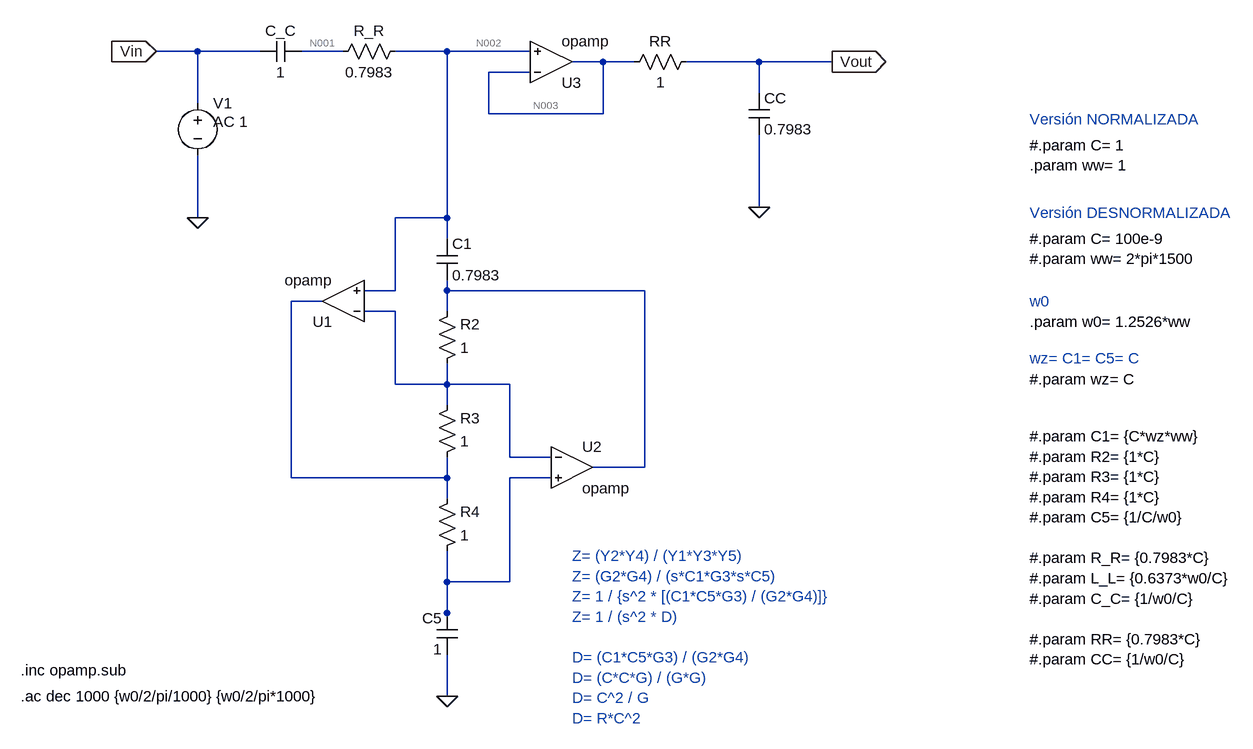
[diagram p0: schematic TS3_LTSpice_FDNR_v2.asc]
TS3_LTSpice_FDNR_v2.asc, the LTspice schematic file:
Version 4
SHEET 1 2464 1004
WIRE -32 -416 -96 -416
WIRE 64 -416 -32 -416
WIRE 192 -416 128 -416
WIRE 352 -416 272 -416
WIRE 480 -416 352 -416
WIRE 592 -400 544 -400
WIRE 640 -400 592 -400
WIRE 832 -400 720 -400
WIRE 944 -400 832 -400
WIRE 480 -384 416 -384
WIRE 832 -352 832 -400
WIRE -32 -336 -32 -416
WIRE 416 -320 416 -384
WIRE 592 -320 592 -400
WIRE 592 -320 416 -320
WIRE 832 -176 832 -288
WIRE -32 -160 -32 -256
WIRE 352 -160 352 -416
WIRE 352 -160 272 -160
WIRE 352 -128 352 -160
WIRE 272 -48 272 -160
WIRE 272 -48 224 -48
WIRE 352 -48 352 -64
WIRE 656 -48 352 -48
WIRE 160 -32 112 -32
WIRE 272 -16 224 -16
WIRE 352 -16 352 -48
WIRE 272 96 272 -16
WIRE 352 96 352 64
WIRE 352 96 272 96
WIRE 448 96 352 96
WIRE 352 128 352 96
WIRE 448 208 448 96
WIRE 512 208 448 208
WIRE 656 224 656 -48
WIRE 656 224 576 224
WIRE 112 240 112 -32
WIRE 352 240 352 208
WIRE 352 240 112 240
WIRE 512 240 448 240
WIRE 352 272 352 240
WIRE 352 400 352 352
WIRE 448 400 448 240
WIRE 448 400 352 400
WIRE 352 448 352 400
WIRE 352 464 352 448
WIRE 352 576 352 512
FLAG -96 -416 Vin
IOPIN -96 -416 In
FLAG 944 -400 Vout
IOPIN 944 -400 Out
FLAG 832 -176 0
FLAG -32 -160 0
FLAG 352 576 0
SYMBOL Opamps\\opamp 192 32 R180
SYMATTR InstName U1
SYMBOL Opamps\\opamp 544 160 R0
SYMATTR InstName U2
SYMBOL cap 336 -64 M180
WINDOW 0 24 56 Left 2
WINDOW 3 24 8 Left 2
SYMATTR InstName C1
SYMATTR Value 0.7983
SYMBOL cap 368 448 M0
SYMATTR InstName C5
SYMATTR Value 1
SYMBOL res 336 80 M180
WINDOW 0 36 76 Left 2
WINDOW 3 36 40 Left 2
SYMATTR InstName R2
SYMATTR Value 1
SYMBOL res 336 224 M180
WINDOW 0 36 76 Left 2
WINDOW 3 36 40 Left 2
SYMATTR InstName R3
SYMATTR Value 1
SYMBOL res 336 368 M180
WINDOW 0 36 76 Left 2
WINDOW 3 36 40 Left 2
SYMATTR InstName R4
SYMATTR Value 1
SYMBOL cap 128 -432 R90
WINDOW 0 0 32 VBottom 2
WINDOW 3 32 32 VTop 2
SYMATTR InstName C_C
SYMATTR Value 1
SYMBOL res 288 -432 R90
WINDOW 0 0 56 VBottom 2
WINDOW 3 32 56 VTop 2
SYMATTR InstName R_R
SYMATTR Value 0.7983
SYMBOL Opamps\\opamp 512 -336 M180
SYMATTR InstName U3
SYMBOL res 736 -416 R90
WINDOW 0 0 56 VBottom 2
WINDOW 3 32 56 VTop 2
SYMATTR InstName RR
SYMATTR Value 1
SYMBOL cap 816 -352 R0
SYMATTR InstName CC
SYMATTR Value 0.7983
SYMBOL voltage -32 -352 R0
WINDOW 123 24 44 Left 2
WINDOW 39 0 0 Left 0
SYMATTR Value2 AC 1
SYMATTR InstName V1
SYMATTR Value ""
TEXT -304 536 Left 2 !.inc opamp.sub
TEXT 544 360 Left 2 ;Z= (Y2*Y4) / (Y1*Y3*Y5)\nZ= (G2*G4) / (s*C1*G3*s*C5)\nZ= 1 / {s^2 * [(C1*C5*G3) / (G2*G4)]}\nZ= 1 / (s^2 * D)\n \nD= (C1*C5*G3) / (G2*G4)\nD= (C*C*G) / (G*G)\nD= C^2 / G\nD= R*C^2
TEXT 1248 -272 Left 2 !#.param C= 1\n.param ww= 1
TEXT 1248 -312 Left 2 ;Versión NORMALIZADA
TEXT 1248 -168 Left 2 ;Versión DESNORMALIZADA
TEXT 1248 -128 Left 2 !#.param C= 100e-9\n#.param ww= 2*pi*1500
TEXT 1248 0 Left 2 !.param w0= 1.2526*ww
TEXT 1248 88 Left 2 !#.param wz= C
TEXT 1248 -32 Left 2 ;w0
TEXT 1248 56 Left 2 ;wz= C1= C5= C
TEXT 1248 176 Left 2 !#.param C1= {C*wz*ww}\n#.param R2= {1*C}\n#.param R3= {1*C}\n#.param R4= {1*C}\n#.param C5= {1/C/w0}\n \n#.param R_R= {0.7983*C}\n#.param L_L= {0.6373*w0/C}\n#.param C_C= {1/w0/C}\n \n#.param RR= {0.7983*C}\n#.param CC= {1/w0/C}
TEXT -304 576 Left 2 !.ac dec 1000 {w0/2/pi/1000} {w0/2/pi*1000}

The netlist it stands for:
* TS3_LTSpice_FDNR_v2.asc
XU1 N006 N002 N005 opamp Aol=100K GBW=10Meg  ; pins invin noninvin out
XU2 N006 N007 N004 opamp Aol=100K GBW=10Meg  ; pins invin noninvin out
C1 N004 N002 0.7983
C5 N007 0 1
R2 N006 N004 1
R3 N005 N006 1
R4 N007 N005 1
C_C N001 Vin 1
R_R N002 N001 0.7983
XU3 N003 N002 N003 opamp Aol=100K GBW=10Meg  ; pins invin noninvin out
RR Vout N003 1
CC Vout 0 0.7983
V1 Vin 0 AC 1
.inc opamp.sub
* Z= (Y2*Y4) / (Y1*Y3*Y5)
* Z= (G2*G4) / (s*C1*G3*s*C5)
* Z= 1 / {s^2 * [(C1*C5*G3) / (G2*G4)]}
* Z= 1 / (s^2 * D)
* D= (C1*C5*G3) / (G2*G4)
* D= (C*C*G) / (G*G)
* D= C^2 / G
* D= R*C^2
#.param C= 1
.param ww= 1
* Versión NORMALIZADA
* Versión DESNORMALIZADA
#.param C= 100e-9
#.param ww= 2*pi*1500
.param w0= 1.2526*ww
#.param wz= C
* w0
* wz= C1= C5= C
#.param C1= {C*wz*ww}
#.param R2= {1*C}
#.param R3= {1*C}
#.param R4= {1*C}
#.param C5= {1/C/w0}
#.param R_R= {0.7983*C}
#.param L_L= {0.6373*w0/C}
#.param C_C= {1/w0/C}
#.param RR= {0.7983*C}
#.param CC= {1/w0/C}
.ac dec 1000 {w0/2/pi/1000} {w0/2/pi*1000}
.backanno
.end

* Results of the author's LTspice run, read from the files saved beside the schematic
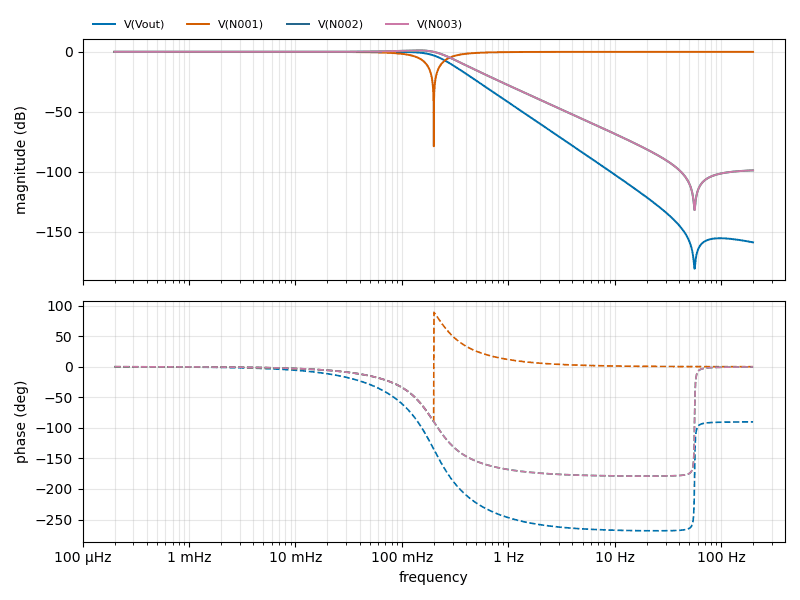
[diagram p1: AC Analysis of TS3_LTSpice_FDNR_v2.asc, plotted from the saved traces]
* AC Analysis, 1 run:
*   V(Vout): -0.00 dB at 199.4 µHz, -158.73 dB at 199.4 Hz, peak -0.00 dB at 206.8 µHz, 3 dB below the peak at 199.4 mHz
*   V(N001): -0.00 dB at 199.4 µHz, -0.00 dB at 199.4 Hz, peak -0.00 dB at 199.4 Hz, 3 dB below the peak at 322.6 mHz
*   V(N002): -0.00 dB at 199.4 µHz, -98.73 dB at 199.4 Hz, peak 1.25 dB at 140.8 mHz, 3 dB below the peak at 233 mHz
*   V(N003): -0.00 dB at 199.4 µHz, -98.73 dB at 199.4 Hz, peak 1.25 dB at 140.8 mHz, 3 dB below the peak at 233 mHz